# Altium schematic sheet ADDER.SchDoc
size A; SheetNumber: 1; SheetTotal: 1
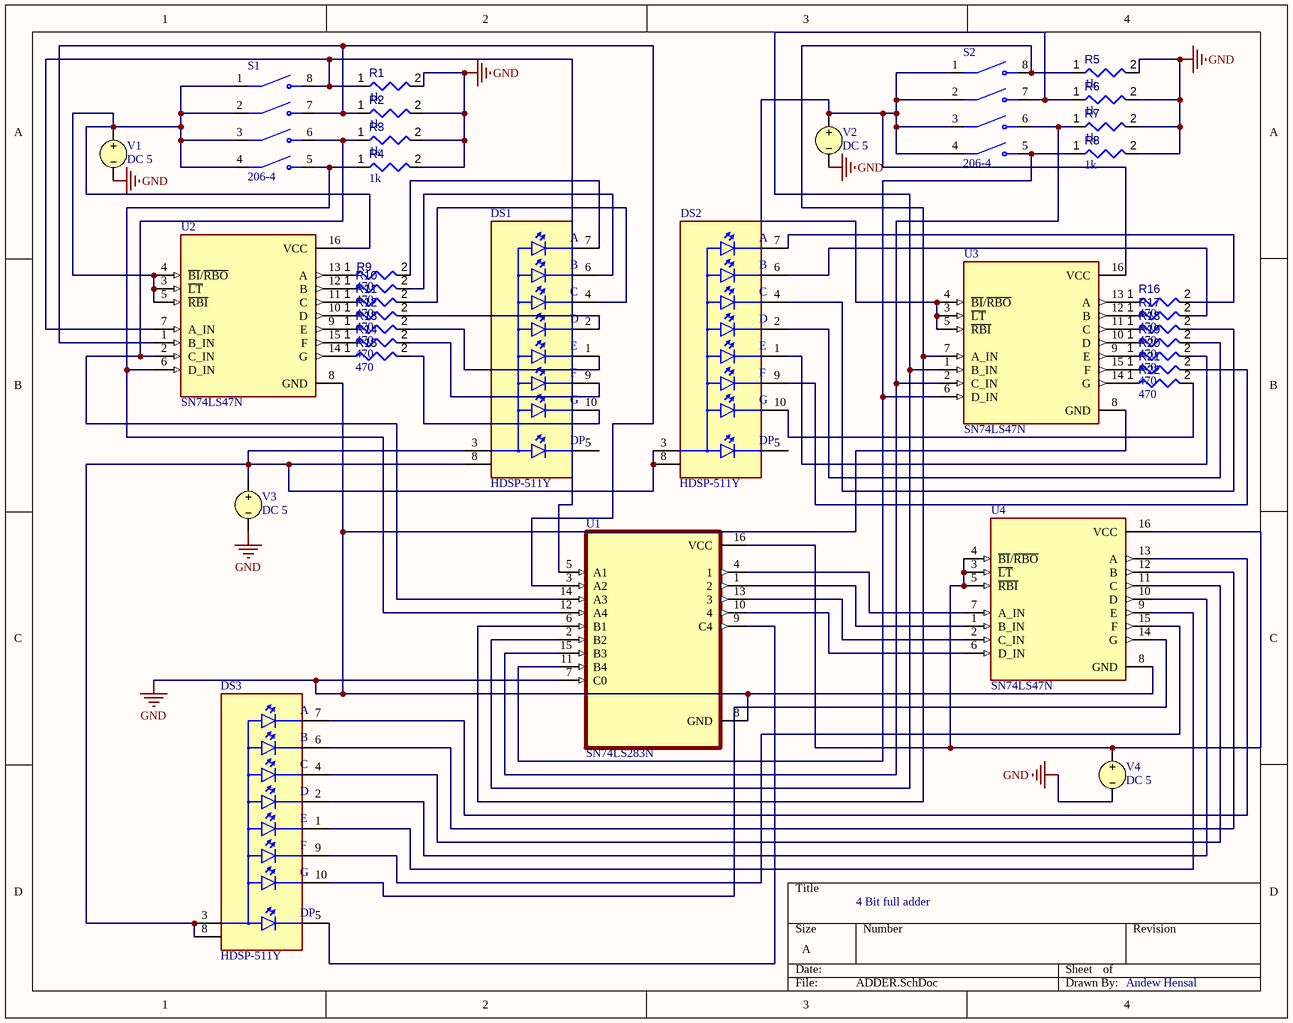
[diagram p0: ADDER.SchDoc]

## Parts
DS1  HDSP-511Y  [LED_HDSP-511Y]
DS2  HDSP-511Y  [LED_HDSP-511Y]
DS3  HDSP-511Y  [LED_HDSP-511Y]
R1  value 1k  [RESC0805(2012)_L]  (hidden comment: Resistor 1K +/-5% 0805 125 mW)
R2  value 1k  [RESC0805(2012)_L]  (hidden comment: Resistor 1K +/-5% 0805 125 mW)
R3  value 1k  [RESC0805(2012)_L]  (hidden comment: Resistor 1K +/-5% 0805 125 mW)
R4  value 1k  [RESC0805(2012)_L]  (hidden comment: Resistor 1K +/-5% 0805 125 mW)
R5  value 1k  [RESC0805(2012)_L]  (hidden comment: Resistor 1K +/-5% 0805 125 mW)
R6  value 1k  [RESC0805(2012)_L]  (hidden comment: Resistor 1K +/-5% 0805 125 mW)
R7  value 1k  [RESC0805(2012)_L]  (hidden comment: Resistor 1K +/-5% 0805 125 mW)
R8  value 1k  [RESC0805(2012)_L]  (hidden comment: Resistor 1K +/-5% 0805 125 mW)
R9  value 470  [RESC0805(2012)_L]  (hidden comment: Resistor 470R +/-5% 0805 125 mW)
R10  value 470  [RESC0805(2012)_L]  (hidden comment: Resistor 470R +/-5% 0805 125 mW)
R11  value 470  [RESC0805(2012)_L]  (hidden comment: Resistor 470R +/-5% 0805 125 mW)
R12  value 470  [RESC0805(2012)_L]  (hidden comment: Resistor 470R +/-5% 0805 125 mW)
R13  value 470  [RESC0805(2012)_L]  (hidden comment: Resistor 470R +/-5% 0805 125 mW)
R14  value 470  [RESC0805(2012)_L]  (hidden comment: Resistor 470R +/-5% 0805 125 mW)
R15  value 470  [RESC0805(2012)_L]  (hidden comment: Resistor 470R +/-5% 0805 125 mW)
R16  value 470  [RESC0805(2012)_L]  (hidden comment: Resistor 470R +/-5% 0805 125 mW)
R17  value 470  [RESC0805(2012)_L]  (hidden comment: Resistor 470R +/-5% 0805 125 mW)
R18  value 470  [RESC0805(2012)_L]  (hidden comment: Resistor 470R +/-5% 0805 125 mW)
R19  value 470  [RESC0805(2012)_L]  (hidden comment: Resistor 470R +/-5% 0805 125 mW)
R20  value 470  [RESC0805(2012)_L]  (hidden comment: Resistor 470R +/-5% 0805 125 mW)
R21  value 470  [RESC0805(2012)_L]  (hidden comment: Resistor 470R +/-5% 0805 125 mW)
R22  value 470  [RESC0805(2012)_L]  (hidden comment: Resistor 470R +/-5% 0805 125 mW)
S1  206-4  [SW_206-4]
S2  206-4  [SW_206-4]
U1  SN74LS283N  [DIP794W45P254L1969H508Q16]
U2  SN74LS47N  [DIP794W45P254L1930H508Q16]
U3  SN74LS47N  [DIP794W45P254L1930H508Q16]
U4  SN74LS47N  [DIP794W45P254L1930H508Q16]
V1  DC 5
V2  DC 5
V3  DC 5
V4  DC 5

## Nets
GND: R1.2 R2.2 R3.2 R4.2 R5.2 R6.2 R7.2 R8.2 U1.7(C0) U1.8(GND) U2.8(GND) U3.8(GND) U4.8(GND) V1.2 V2.2 V3.2 V4.2
NetDS1_1: DS1.1(E) R13.2
NetDS1_2: DS1.2(D) R12.2
NetDS1_3: DS1.3(COM) DS1.8(COM) DS2.3(COM) DS2.8(COM) DS3.3(COM) DS3.8(COM) V3.1
NetDS1_4: DS1.4(C) R11.2
NetDS1_6: DS1.6(B) R10.2
NetDS1_7: DS1.7(A) R9.2
NetDS1_9: DS1.9(F) R14.2
NetDS1_10: DS1.10(G) R15.2
NetDS2_1: DS2.1(E) R20.2
NetDS2_2: DS2.2(D) R19.2
NetDS2_4: DS2.4(C) R18.2
NetDS2_6: DS2.6(B) R17.2
NetDS2_7: DS2.7(A) R16.2
NetDS2_9: DS2.9(F) R21.2
NetDS2_10: DS2.10(G) R22.2
NetDS3_1: DS3.1(E) U4.9(E)
NetDS3_2: DS3.2(D) U4.10(D)
NetDS3_4: DS3.4(C) U4.11(C)
NetDS3_5: DS3.5(DP) U1.9(C4)
NetDS3_6: DS3.6(B) U4.12(B)
NetDS3_7: DS3.7(A) U4.13(A)
NetDS3_9: DS3.9(F) U4.15(F)
NetDS3_10: DS3.10(G) U4.14(G)
NetR1_1: R1.1 S1.8(NO1) U1.5(A1) U2.7(A_IN)
NetR2_1: R2.1 S1.7(NO2) U1.3(A2) U2.1(B_IN)
NetR3_1: R3.1 S1.6(NO3) U1.14(A3) U2.2(C_IN)
NetR4_1: R4.1 S1.5(NO4) U1.12(A4) U2.6(D_IN)
NetR5_1: R5.1 S2.8(NO1) U1.6(B1) U3.7(A_IN)
NetR6_1: R6.1 S2.7(NO2) U1.2(B2) U3.1(B_IN)
NetR7_1: R7.1 S2.6(NO3) U1.15(B3) U3.2(C_IN)
NetR8_1: R8.1 S2.5(NO4) U1.11(B4) U3.6(D_IN)
NetR9_1: R9.1 U2.13(A)
NetR10_1: R10.1 U2.12(B)
NetR11_1: R11.1 U2.11(C)
NetR12_1: R12.1 U2.10(D)
NetR13_1: R13.1 U2.9(E)
NetR14_1: R14.1 U2.15(F)
NetR15_1: R15.1 U2.14(G)
NetR16_1: R16.1 U3.13(A)
NetR17_1: R17.1 U3.12(B)
NetR18_1: R18.1 U3.11(C)
NetR19_1: R19.1 U3.10(D)
NetR20_1: R20.1 U3.9(E)
NetR21_1: R21.1 U3.15(F)
NetR22_1: R22.1 U3.14(G)
NetS1_1: S1.1(COM1) S1.2(COM2) S1.3(COM3) S1.4(COM4) U2.3(~{LT}) U2.4(~{BI}/~{RBO}) U2.5(~{RBI}) U2.16(VCC) V1.1
NetS2_1: S2.1(COM1) S2.2(COM2) S2.3(COM3) S2.4(COM4) U3.3(~{LT}) U3.4(~{BI}/~{RBO}) U3.5(~{RBI}) U3.16(VCC) V2.1
NetU1_1: U1.1(2) U4.1(B_IN)
NetU1_4: U1.4(1) U4.7(A_IN)
NetU1_10: U1.10(4) U4.6(D_IN)
NetU1_13: U1.13(3) U4.2(C_IN)
NetU1_16: U1.16(VCC) U4.3(~{LT}) U4.4(~{BI}/~{RBO}) U4.5(~{RBI}) U4.16(VCC) V4.1

Not connected (* = marked no-connect by the designer): DS1 5(DP); DS2 5(DP)

## Notes on the sheet
- 4 Bit full adder
- Andew Hensal

## Library data of the parts
DS1-DS3 = HDSP-511Y: Display Modules - LED Character and Numeric Yellow 7-Segment 1 Character Common Anode 2.15V 20mA 0.673 H x 0.488 W x 0.315 D (17.10mm x 12.40mm x 8.00mm) 10-DIP (0.600, 15.24mm); MF: Broadcom Limited; SnapEDA_Link: https://www.snapeda.com/parts/HDSP-511Y/Broadcom/view-part/?ref=snap; Package: None; Value: *; MP: HDSP-511Y; Check_prices: https://www.snapeda.com/parts/HDSP-511Y/Broadcom/view-part/?ref=eda
R1-R8 = CMP-009-00118-3: Chip Resistor, 1 kOhms, +/-5%, 125 mW, -55 to 155 degC, 0805; Tolerance: 5%; Power: 125mW; Case/Package: 0805; Pins: 2; Min Operating Temperature: -55°C; Max Operating Temperature: 155°C
R9-R22 = CMP-009-00122-3: Chip Resistor, 470 Ohms, +/-5%, 125 mW, -55 to 155 degC, 0805; Tolerance: 5%; Power: 125mW; Max Operating Temperature: 155°C; Case/Package: 0805; Pins: 2; Min Operating Temperature: -55°C
S1 S2 = 206-4: MF: {'manufacturer': u'CTS Components'}; Package: None; Price: None; Value: *; MP: 206-4; Availability: Unavailable
U1 = SN74LS283N: 4-Bit Binary Full Adders With Fast Carry 16-PDIP 0 to 70; MF: Texas Instruments; MP: SN74LS283N; Package: PDIP-16 Texas Instruments; Availability: Good; Value: *; Price: None; Check_prices: https://www.snapeda.com/parts/SN74LS283N/Texas%20Instruments/view-part/454899/?ref=eda; SnapEDA_Link: https://www.snapeda.com/parts/SN74LS283N/Texas%20Instruments/view-part/454899/?ref=snap; Purchase-URL: https://pricing.snapeda.com/search/part/SN74LS283N/?ref=eda
U2-U4 = SN74LS47N: BCD-to-Seven-Segment Decoders/Drivers; MF: Texas Instruments; SnapEDA_Link: https://www.snapeda.com/parts/SN74LS47N/Texas+Instruments/view-part/?ref=snap; Package: PDIP-16 Texas Instruments; Value: *; MP: SN74LS47N; Check_prices: https://www.snapeda.com/parts/SN74LS47N/Texas+Instruments/view-part/?ref=eda
V1-V4 = VSRC: Voltage Source; Note: PCB Footprint - Not required; AC Magnitude: 1; AC Phase: 0; Value: 5; Published: 8-Jun-2000; LatestRevisionDate: 17-Jul-2002; LatestRevisionNote: Re-released for DXP Platform.; PackageReference: Not Applicable; Publisher: Altium Limited